# Altium project BG0249_R1M1E1.PrjPcb
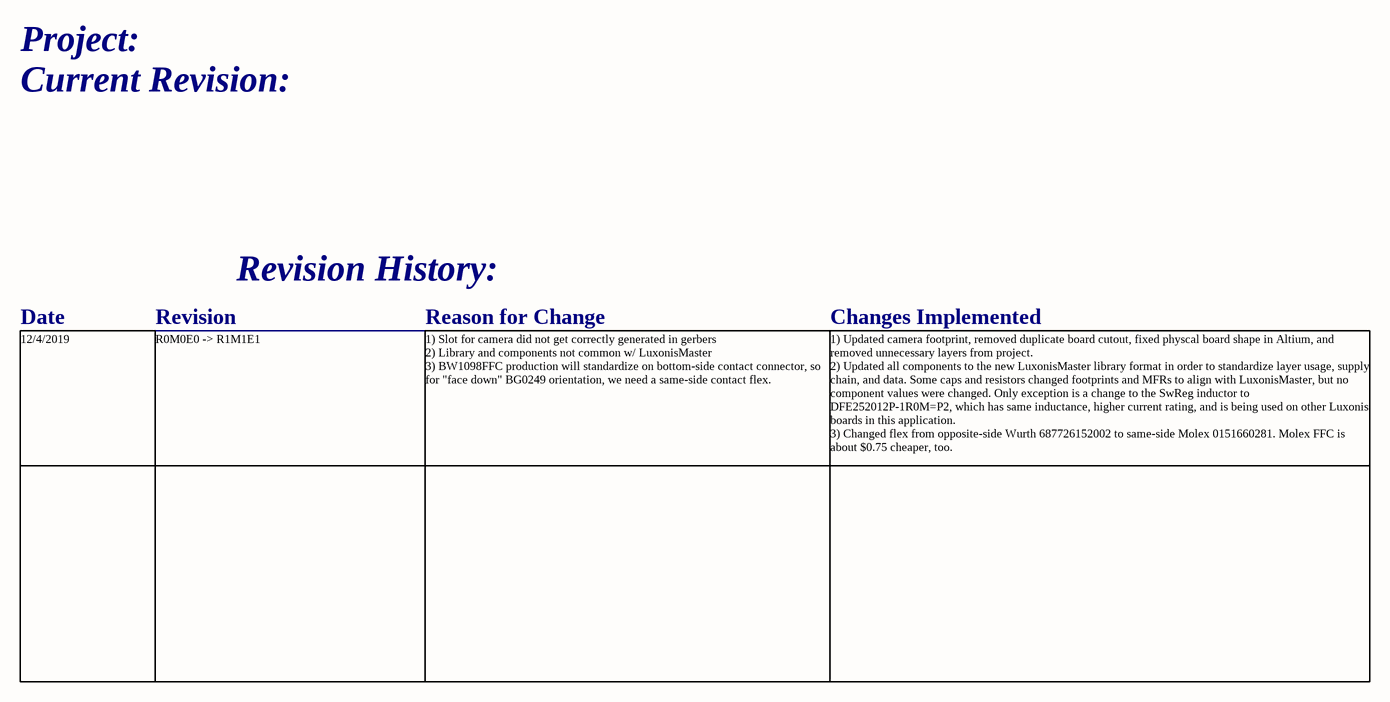
[diagram p0: Project_Information.SchDoc]
document_number: D000103; drawn_by: Brian Weinstein; project_title: BG0249; revision: R1M1E1
2 sheets, 24 parts. Net scope: global (net labels, ports and power ports of the same name join across sheets).
Board file: BG0249_R1M1E1.PcbDoc
Sheets:
  Project_Information.SchDoc
  BG0249_R1M1E1_BW235_IMX378.SchDoc

## Sheet Project_Information.SchDoc: =project_title
size Tabloid; CompanyName: Luxonis Holding; DrawnBy: Brian Weinstein; Organization: Luxonis Holding; Address1: 1925 Harmony Park Drive; Address2: Westminster, CO; Address3: 80234; Address4: United States; DocumentNumber: D000103; Revision: R1M1E1; SheetNumber: 1; SheetTotal: 3

### Notes on the sheet
- Project:
- Current Revision:
- Revision History:
- Date
- Revision
- Reason for Change
- Changes Implemented
- 12/4/2019
- R0M0E0 -> R1M1E1
- 1) Slot for camera did not get correctly generated in gerbers
  2) Library and components not common w/ LuxonisMaster
  3) BW1098FFC production will standardize on bottom-side contact connector, so for "face down" BG0249 orientation, we need a same-side contact flex.
- 1) Updated camera footprint, removed duplicate board cutout, fixed physcal board shape in Altium, and removed unnecessary layers from project.
  2) Updated all components to the new LuxonisMaster library format in order to standardize layer usage, supply chain, and data. Some caps and resistors changed footprints and MFRs to align with LuxonisMaster, but no component values were changed. Only exception is a change to the SwReg inductor to DFE252012P-1R0M=P2, which has same inductance, higher current rating, and is being used on other Luxonis boards in this application.
  3) Changed flex from opposite-side Wurth 687726152002 to same-side Molex 0151660281. Molex FFC is about $0.75 cheaper, too.
- Title
- Size:
- Date:
- Tabloid
- Number:
- Time:
- Revision:
- Sheet
- of
- Drawn by:

## Sheet BG0249_R1M1E1_BW235_IMX378.SchDoc: =project_title
size Tabloid; PageSetup: Record=PageOptions|CenterHorizontal=True|CenterVertical=True|PrintScale=0.71|XCorrection=1.00|YCorrection=1.00|PrintKind=0|BorderSize=5000000|LeftOffset=0|BottomOffset=0|Orientation=2|PaperLength=1000|PaperWidth=1000|Scale=100|PaperSource=7|PrintQuality=-4|MediaType=1|DitherType=10|PrintScaleMode=1|PaperKind=A4; CompanyName: Luxonis Holding; DrawnBy: Brian Weinstein; Organization: Luxonis Holding; Address1: 1925 Harmony Park Drive; Address2: Westminster, CO; Address3: 80234; Address4: United States; DocumentNumber: D000103; Revision: R1M1E1; SheetNumber: 3; SheetTotal: 3
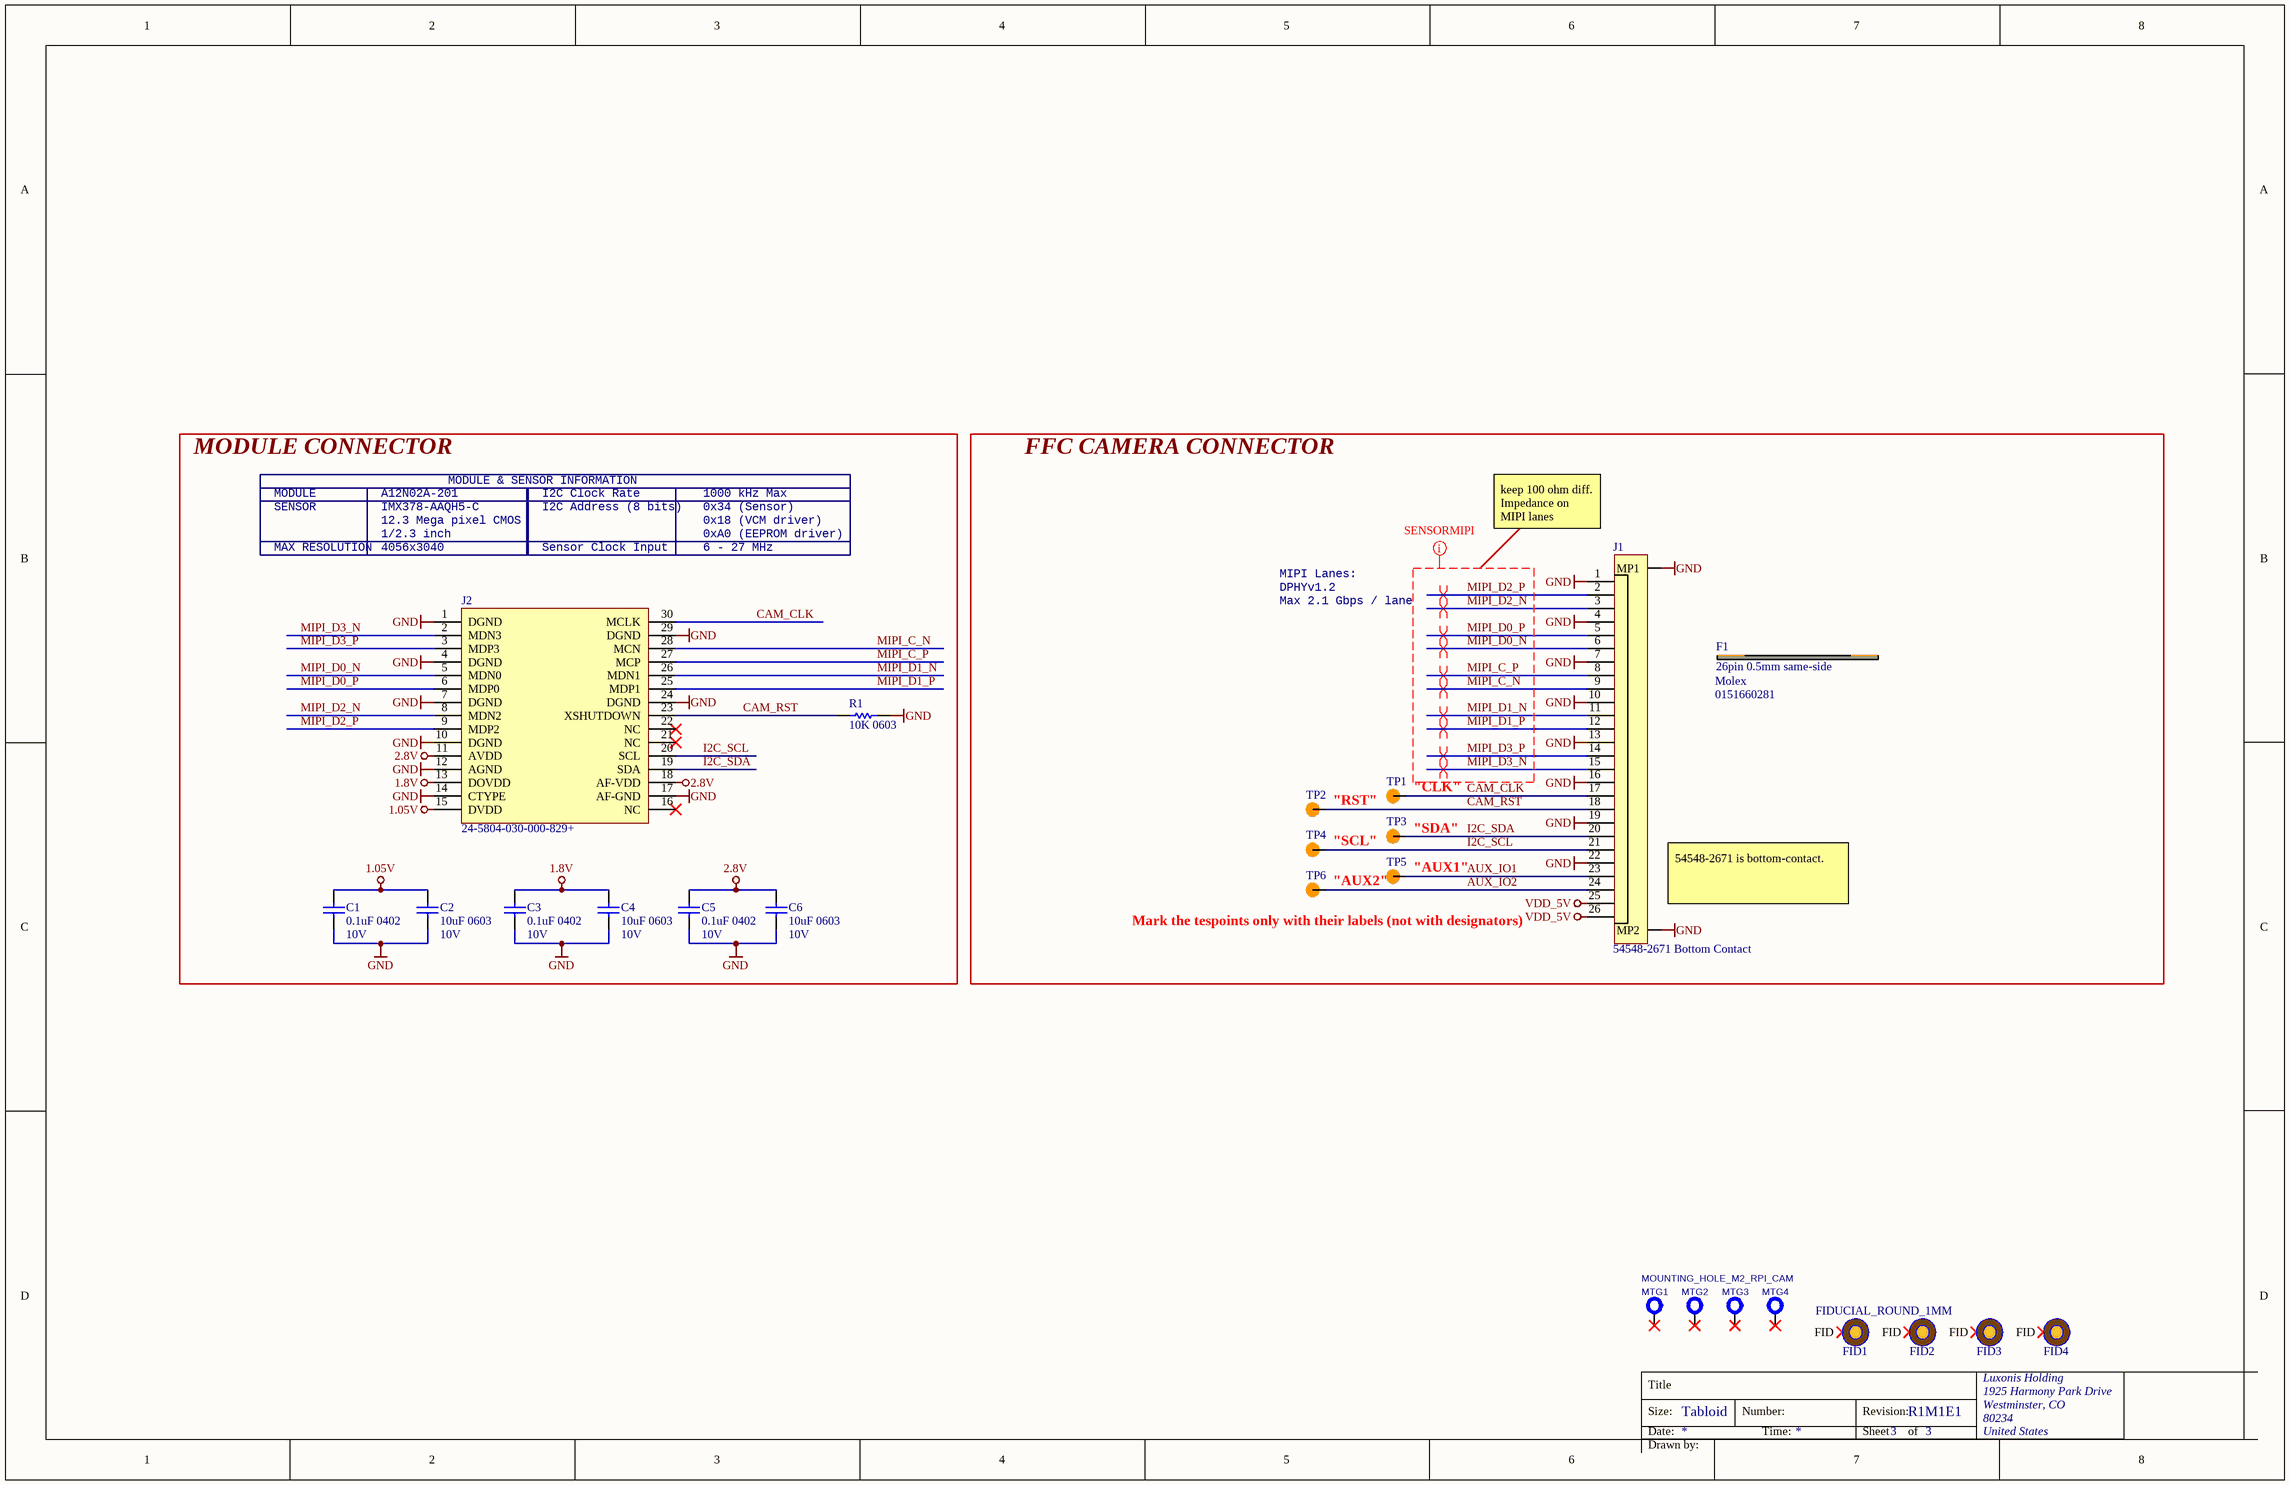
[diagram p1: BG0249_R1M1E1_BW235_IMX378.SchDoc]

### Parts
C1  0.1uF 0402  Voltage Rating: 10V  [CAPC0402(1005)70_N]
C2  10uF 0603  Voltage Rating: 10V  [CAPC0603(1608)100_N]
C3  0.1uF 0402  Voltage Rating: 10V  [CAPC0402(1005)70_N]
C4  10uF 0603  Voltage Rating: 10V  [CAPC0603(1608)100_N]
C5  0.1uF 0402  Voltage Rating: 10V  [CAPC0402(1005)70_N]
C6  10uF 0603  Voltage Rating: 10V  [CAPC0603(1608)100_N]
F1  26pin 0.5mm same-side  Manufacturer 1: Molex  (mechanical)
FID1  FIDUCIAL_ROUND_1MM  [FIDUCIAL_ROUND_1MM]  (no BOM)
FID2  FIDUCIAL_ROUND_1MM  [FIDUCIAL_ROUND_1MM]  (value not drawn)  (no BOM)
FID3  FIDUCIAL_ROUND_1MM  [FIDUCIAL_ROUND_1MM]  (value not drawn)  (no BOM)
FID4  FIDUCIAL_ROUND_1MM  [FIDUCIAL_ROUND_1MM]  (value not drawn)  (no BOM)
J1  54548-2671 Bottom Contact  [54548-2671]
J2  24-5804-030-000-829+  [A12N02A-201_MatedModule]
MTG1  MOUNTING_HOLE_M2_RPI_CAM  [MOUNTING_HOLE_M2_RPI_CAM]  (no BOM)
MTG2  MOUNTING_HOLE_M2_RPI_CAM  [MOUNTING_HOLE_M2_RPI_CAM]  (value not drawn)  (no BOM)
MTG3  MOUNTING_HOLE_M2_RPI_CAM  [MOUNTING_HOLE_M2_RPI_CAM]  (value not drawn)  (no BOM)
MTG4  MOUNTING_HOLE_M2_RPI_CAM  [MOUNTING_HOLE_M2_RPI_CAM]  (value not drawn)  (no BOM)
R1  10K 0603  [RESC0603(1608)_N]
TP1  TP100_150_NS  [TP100_150_NS]  (value not drawn)  (no BOM)
TP2  TP100_150_NS  [TP100_150_NS]  (value not drawn)  (no BOM)
TP3  TP100_150_NS  [TP100_150_NS]  (value not drawn)  (no BOM)
TP4  TP100_150_NS  [TP100_150_NS]  (value not drawn)  (no BOM)
TP5  TP100_150_NS  [TP100_150_NS]  (value not drawn)  (no BOM)
TP6  TP100_150_NS  [TP100_150_NS]  (value not drawn)  (no BOM)

### Blocks framed on the sheet
MODULE CONNECTOR: C1-C6 J2 R1
FFC CAMERA CONNECTOR: F1 J1 TP1-TP6

### Nets
1.05V: C1.2 C2.2 J2.15(DVDD)
1.8V: C3.2 C4.2 J2.13(DOVDD)
2.8V: C5.2 C6.2 J2.11(AVDD) J2.18(AF-VDD)
GND: C1.1 C2.1 C3.1 C4.1 C5.1 C6.1 J1.1 J1.4 J1.7 J1.10 J1.13 J1.16 J1.19 J1.22 J1.MP1 J1.MP2 J2.1(DGND) J2.4(DGND) J2.7(DGND) J2.10(DGND) J2.12(AGND) J2.14(CTYPE) J2.17(AF-GND) J2.24(DGND) J2.29(DGND) R1.2
VDD_5V: J1.25 J1.26
AUX_IO1: J1.23 TP5.1
AUX_IO2: J1.24 TP6.1
CAM_CLK: J1.17 J2.30(MCLK) TP1.1
CAM_RST: J1.18 J2.23(XSHUTDOWN) R1.1 TP2.1
I2C_SCL: J1.21 J2.20(SCL) TP4.1
I2C_SDA: J1.20 J2.19(SDA) TP3.1
MIPI_C_N: J1.9 J2.28(MCN)
MIPI_C_P: J1.8 J2.27(MCP)
MIPI_D0_N: J1.6 J2.5(MDN0)
MIPI_D0_P: J1.5 J2.6(MDP0)
MIPI_D1_N: J1.11 J2.26(MDN1)
MIPI_D1_P: J1.12 J2.25(MDP1)
MIPI_D2_N: J1.3 J2.8(MDN2)
MIPI_D2_P: J1.2 J2.9(MDP2)
MIPI_D3_N: J1.15 J2.2(MDN3)
MIPI_D3_P: J1.14 J2.3(MDP3)

Not connected (* = marked no-connect by the designer): FID1 FID*; FID2 FID*; FID3 FID*; FID4 FID*; J2 16(NC)* 21(NC)* 22(NC)*; MTG1 1*; MTG2 1*; MTG3 1*; MTG4 1*

### Layout directives
net class SENSORMIPI: MIPI_C_N, MIPI_C_P, MIPI_D0_N, MIPI_D0_P, MIPI_D1_N, MIPI_D1_P, MIPI_D2_N, MIPI_D2_P, MIPI_D3_N, MIPI_D3_P
differential pair: MIPI_C_N, MIPI_C_P, MIPI_D0_N, MIPI_D0_P, MIPI_D1_N, MIPI_D1_P, MIPI_D2_N, MIPI_D2_P, MIPI_D3_N, MIPI_D3_P

### Notes on the sheet
- MODULE
- A12N02A-201
- MODULE & SENSOR INFORMATION
- I2C Clock Rate
- 1000 kHz Max
- SENSOR
- MAX RESOLUTION
- 12.3 Mega pixel CMOS
- 4056x3040
- IMX378-AAQH5-C
- 1/2.3 inch
- I2C Address (8 bits)
- Sensor Clock Input
- 0x34 (Sensor)
- 0x18 (VCM driver)
- 0xA0 (EEPROM driver)
- 6 - 27 MHz
- (near J1) keep 100 ohm diff. Impedance on MIPI lanes
- MIPI Lanes:
- Max 2.1 Gbps / lane
- DPHYv1.2
- "RST"
- "SDA"
- (near TP1) "CLK"
- "SCL"
- "AUX2"
- "AUX1"
- (near J1) 54548-2671 is bottom-contact.
- Mark the tespoints only with their labels (not with designators)
- Title
- Size:
- Date:
- Tabloid
- Number:
- Time:
- Revision:
- Sheet
- of
- Drawn by:

### Library data of the parts
C1 C3 C5 = GRM155R71A104JA01D: CAP CER 0.1UF 10V X7R 0402 5%; Manufacturer 1: Murata; Capacitance: 100nF; Supplier 1: Digi-Key; Manufacturer Part Number 1: GRM155R71A104JA01D; Stock 1: 1346709; Pricing 1: 1=0.10000, 10=0.02500, 100=0.01130, 500=0.00806, 1000=0.00633, 2500=0.00575, 5000=0.00529 (USD); RoHS: Yes; Mount: Surface Mount; Case/Package: 0402; Case Code (Imperial): 0402; Case Code (Metric): 1005; Min Operating Temperature: -55°C; Max Operating Temperature: 125°C; Tolerance: 5%; Packaging: Tape and Reel; Voltage Rating (DC): 10V; Dielectric: X7R; Package Quantity: 10000; Termination: SMD/SMT; Length: 1mm; Height: 0.5mm; Width: 0.02inch; Thickness: 0.022inch; Depth: 0.5mm; Radiation Hardening: No; Lead Free: Lead Free; ComponentLink1URL: https://datasheet.ciiva.com/5411/product-5411135.pdf?src-supplier=Mouser; ComponentLink1Description: https://datasheet.ciiva.com/5411/product-5411135.pdf?src-supplier=Mouser; ComponentLink2URL: https://datasheet.ciiva.com/11618/c02e-11618821.pdf?src-supplier=Avnet; ComponentLink2Description: https://datasheet.ciiva.com/11618/c02e-11618821.pdf?src-supplier=Avnet; Supplier Part Number 1: 490-10777-1-ND
C2 C4 C6 = GRM188R61A106ME69D: CAP CER 10UF 10V X5R 0603 20%; Manufacturer 1: Murata; Material: Ceramic; Supplier 1: Digi-Key; Manufacturer Part Number 1: GRM188R61A106ME69D; Stock 1: 2873098; Pricing 1: 1=0.21000, 10=0.14100, 100=0.07130, 500=0.04876, 1000=0.04313 (USD); RoHS: Yes; Mount: Surface Mount; Case/Package: 0603; Weight: 0.000222oz; Case Code (Metric): 1608; Case Code (Imperial): 0603; Min Operating Temperature: -55°C; Max Operating Temperature: 85°C; Packaging: Tape and Reel; Tolerance: 20%; Capacitance: 10uF; Dielectric: X5R; Voltage Rating (DC): 10V; Package Quantity: 4000; Termination: SMD/SMT; Length: 1.6mm; Height: 0.8mm; Width: 0.8mm; Thickness: 0.035inch; Depth: 0.8mm; REACH SVHC: Unknown; Lead Free: Lead Free; ComponentLink1URL: http://www.mouser.com/ds/2/281/c02e-2905.pdf?src-supplier=Mouser; ComponentLink1Description: http://www.mouser.com/ds/2/281/c02e-2905.pdf?src-supplier=Mouser; ComponentLink2URL: http://components.arrow.com/part/dataview/0323_06119472?src-supplier=Arrow+Europe; ComponentLink2Description: http://components.arrow.com/part/dataview/0323_06119472?src-supplier=Arrow+Europe; ComponentLink3URL: http://www.farnell.com/datasheets/2048014.pdf?src-supplier=Farnell; ComponentLink3Description: http://www.farnell.com/datasheets/2048014.pdf?src-supplier=Farnell; ComponentLink4URL: http://www.farnell.com/datasheets/1872210.pdf?src-supplier=Farnell; ComponentLink4Description: http://www.farnell.com/datasheets/1872210.pdf?src-supplier=Farnell; ComponentLink5URL: http://search.murata.co.jp/Ceramy/image/img/A01X/G101/ENG/GRM188R61A106ME69-01.pdf?src-supplier=Digi-Key; ComponentLink5Description: http://search.murata.co.jp/Ceramy/image/img/A01X/G101/ENG/GRM188R61A106ME69-01.pdf?src-supplier=Digi-Key; ComponentLink6URL: http://www.farnell.com/datasheets/1872210.pdf?src-supplier=Newark; ComponentLink6Description: http://www.farnell.com/datasheets/1872210.pdf?src-supplier=Newark; ComponentLink7URL: http://www.farnell.com/datasheets/2048014.pdf?src-supplier=Element14; ComponentLink7Description: http://www.farnell.com/datasheets/2048014.pdf?src-supplier=Element14; ComponentLink8URL: http://www.farnell.com/datasheets/2048014.pdf?src-supplier=Newark; ComponentLink8Description: http://www.farnell.com/datasheets/2048014.pdf?src-supplier=Newark; Supplier Part Number 1: 490-10475-1-ND
F1 = 0151660281: CABLE FFC 26POS 0.50MM 6"; Number of Conductors: 26; Wire/Cable Type: Flat Flex; Pitch: 0.02inch; Supplier 1: Digi-Key; Manufacturer Part Number 1: 0151660281; Stock 1: 118; Pricing 1: 1=2.21000, 10=2.01000, 25=1.88680, 50=1.80460, 100=1.72260, 250=1.55856, 500=1.43552, 1000=1.23045, 2500=1.14842 (USD); RoHS: Yes; Number of Pins: 26; Packaging: Bulk; Package Quantity: 1000; Length: 6inch; Cable Pitch: 0.5mm; Radiation Hardening: No; ComponentLink1URL: https://datasheet.ciiva.com/10989/0151660281-cable-10989152.pdf?src-supplier=Avnet; ComponentLink1Description: https://datasheet.ciiva.com/10989/0151660281-cable-10989152.pdf?src-supplier=Avnet; ComponentLink2URL: https://datasheet.ciiva.com/2944/151660051-sd-2944673.pdf?src-supplier=Digi-Key; ComponentLink2Description: https://datasheet.ciiva.com/2944/151660051-sd-2944673.pdf?src-supplier=Digi-Key; Supplier 2: Mouser; Supplier Part Number 1: WM11334-ND; Supplier Part Number 2: 538-15166-0281
FID1-FID4 = FIDUCIAL: Fiducial with various available footprints
J1 = 54548-2671: CONN FFC BOTTOM 26POS 0.50MM R/A 26 Position FFC, FPC Connector Contacts, Bottom 0.020" (0.50mm) Surface Mount, Right Angle; Manufacturer_Name: Molex; Actuator Material: Polyphenylene; Current Rating: 500mA; Voltage Rating: 50V; Contact Resistance: 40mR; Number of Positions: 26; Wire/Cable Type: Straight; Pitch: 0.5mm; Datasheet Link: https://www.molex.com/molex/products/datasheet.jsp?part=active/0545482671_FFC_FPC_CONNECTORS.xml&channel=Products&Lang=en-US; Height: 1mm; Manufacturer_Part_Number: 54548-2671; Mouser Part Number: 538-54548-2671; Mouser Price/Stock: https://eu.mouser.com/ProductDetail/Molex/54548-2671?qs=sGAEpiMZZMs7i6cT6ogu49DbkzKdWzYdwOJCTNigfgU%3D; RoHS: Yes; Mount: Surface Mount; Contact Material: Bronze; Contact Plating: Gold; Housing Material: Polymer; Housing Color: Black; Min Operating Temperature: -20°C; Max Operating Temperature: 85°C; Number of Rows: 1; Package Quantity: 750; Packaging: Tape and Reel; Termination: Solder; Number of Contacts: 26; Orientation: Right Angle; Length: 18.2mm; Depth: 5mm; Flammability Rating: UL94 V-0; ComponentLink1URL: https://datasheet.ciiva.com/5137/0545482671-ffc-fpc-connectors-146697-5137857.pdf?src-supplier=Mouser; ComponentLink1Description: https://datasheet.ciiva.com/5137/0545482671-ffc-fpc-connectors-146697-5137857.pdf?src-supplier=Mouser; Supplier 1: Mouser; Manufacturer 1: Molex; Manufacturer Part Number 1: 54548-2671; Stock 1: 6344; Pricing 1: 1=3.03000, 10=2.86000, 25=2.55000, 100=2.42000, 250=2.12000, 500=2.07000 (USD); Supplier 2: Arrow; Manufacturer 2: Molex; Manufacturer Part Number 2: 54548-2671; Stock 2: 11173; Pricing 2: 1=3.50200, 10=3.34800, 25=3.06600, 100=2.78390, 250=2.43800, 500=2.41400, 1000=2.25990, 3000=2.10600, 6000=1.95200, 12000=1.73300, 24000=1.71600, 48000=1.69900, 60000=1.68200 (USD); Supplier Part Number 2: 0545482671; Supplier Part Number 1: 538-54548-2671; System: Connector
J2 = A12N02A-201_Connector: CONN Series 5804 board to board 0.4mm pitch 30 way connector; Manufacturer 1: Kyocera International Electronic Components; Manufacturer Part Number 1: 245804030000829+; MAN: AVX/KYOCERA; MAN PN: 24-5804-030-000-829+; Supplier 1: Digi-Key; Stock 1: 11469; Pricing 1: 1=1.69000, 10=1.53600, 25=1.44200, 50=1.37940, 100=1.31670, 250=1.19132, 500=1.09726, 1000=0.94050 (USD); RoHS: No; ComponentLink1URL: http://global.kyocera.com/prdct/electro/product/pdf/5804.pdf?src-supplier=Digi-Key; ComponentLink1Description: http://global.kyocera.com/prdct/electro/product/pdf/5804.pdf?src-supplier=Digi-Key; Supplier Part Number 1: 478-12013-1-ND
MTG1-MTG4 = MP_Mounting-Holes: =CurrentFootprint; B - Value: Not a Part; A - Level: 0
R1 = RC0603FR-0710KL: RES SMD 10K OHM 1% 1/10W 0603; Manufacturer 1: Yageo; Resistance: 10kR; Power Rating: 100mW; Temperature Coefficient: 100ppm/°C; Voltage Rating: 75V; Voltage Rating (DC): 50V; Supplier 1: Digi-Key; Manufacturer Part Number 1: RC0603FR-0710KL; Stock 1: 80414305; Pricing 1: 1=0.10000, 10=0.02200, 100=0.00890, 1000=0.00401, 2500=0.00348 (USD); RoHS: Yes; Case/Package: 0603; Number of Pins: 2; Weight: 7.1E-05oz; Case Code (Imperial): 0603; Case Code (Metric): 1608; Min Operating Temperature: -55°C; Max Operating Temperature: 155°C; Packaging: Tape and Reel; Tolerance: 1%; Composition: Thick Film; Termination: SMD/SMT; Military Standard: Not; Length: 1.6mm; Height: 0.45mm; Depth: 0.8mm; Width: 0.8mm; Lead Pitch: 0.3mm; Lead Free: Lead Free; REACH SVHC: No SVHC; ComponentLink1URL: https://datasheet.ciiva.com/7660/38590-7660789.pdf?src-supplier=Element14; ComponentLink1Description: https://datasheet.ciiva.com/7660/38590-7660789.pdf?src-supplier=Element14; ComponentLink2URL: https://datasheet.ciiva.com/15189/getdatasheetpartid-409289-15189591.pdf?src-supplier=Verical; ComponentLink2Description: https://datasheet.ciiva.com/15189/getdatasheetpartid-409289-15189591.pdf?src-supplier=Verical; ComponentLink3URL: https://datasheet.ciiva.com/46440/1868787-46440891.pdf?src-supplier=Element14; ComponentLink3Description: https://datasheet.ciiva.com/46440/1868787-46440891.pdf?src-supplier=Element14; ComponentLink4URL: https://datasheet.ciiva.com/7983/443971-7983596.pdf?src-supplier=Element14; ComponentLink4Description: https://datasheet.ciiva.com/7983/443971-7983596.pdf?src-supplier=Element14; ComponentLink5URL: https://datasheet.ciiva.com/7746/1738695-7746239.pdf?src-supplier=Element14; ComponentLink5Description: https://datasheet.ciiva.com/7746/1738695-7746239.pdf?src-supplier=Element14; ComponentLink6URL: https://datasheet.ciiva.com/22747/443971-22747519.pdf?src-supplier=Element14; ComponentLink6Description: https://datasheet.ciiva.com/22747/443971-22747519.pdf?src-supplier=Element14; Supplier 2: Digi-Key; Manufacturer 2: Yageo; Manufacturer Part Number 2: RC0603FR-0710KL; Stock 2: 80414305; Pricing 2: 1=0.10000, 10=0.02200, 100=0.00890, 1000=0.00401, 2500=0.00348 (USD); Supplier 3: Digi-Key; Manufacturer 3: Yageo; Manufacturer Part Number 3: RC0603FR-0710KL; Stock 3: 80410000; Pricing 3: 5000=0.00261, 10000=0.00227, 25000=0.00199, 50000=0.00183, 125000=0.00179 (USD); Supplier Part Number 1: 311-10.0KHRCT-ND; Supplier Part Number 2: 311-10.0KHRDKR-ND; Supplier Part Number 3: 311-10.0KHRTR-ND
TP1-TP6 = TEST_POINT

## Assembly variants
Production: all parts fitted